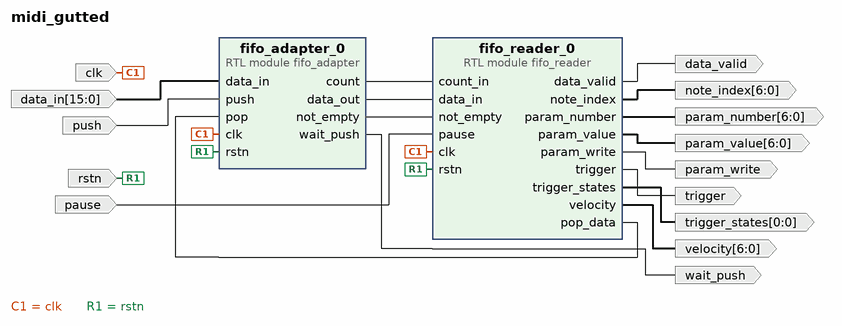
[diagram p0: block diagram of the top level]
# Vivado block design midi_gutted, xc7z020clg400-1, Vivado 2021.1
create_bd_design midi_gutted

create_bd_port -dir I -type clk clk
set_property -dict {CONFIG.FREQ_HZ 100000000} [get_bd_ports clk]
create_bd_port -dir I -type rst rstn
set_property -dict {CONFIG.POLARITY ACTIVE_LOW} [get_bd_ports rstn]
create_bd_port -dir I -from 15 -to 0 data_in
create_bd_port -dir I push
create_bd_port -dir O wait_push
create_bd_port -dir O data_valid
create_bd_port -dir O -from 6 -to 0 note_index
create_bd_port -dir O -from 6 -to 0 param_number
create_bd_port -dir O -from 6 -to 0 param_value
create_bd_port -dir O param_write
create_bd_port -dir I pause
create_bd_port -dir O trigger
create_bd_port -dir O -from 0 -to 0 trigger_states
create_bd_port -dir O -from 6 -to 0 velocity

create_bd_cell -type module -reference fifo_adapter fifo_adapter_0
create_bd_cell -type module -reference fifo_reader fifo_reader_0

# ---- connections ----

connect_bd_net [get_bd_ports clk] [get_bd_pins fifo_adapter_0/clk] [get_bd_pins fifo_reader_0/clk]
connect_bd_net -net data_in_0_1 [get_bd_ports data_in] [get_bd_pins fifo_adapter_0/data_in]
connect_bd_net [get_bd_pins fifo_adapter_0/count] [get_bd_pins fifo_reader_0/count_in]
connect_bd_net [get_bd_pins fifo_adapter_0/data_out] [get_bd_pins fifo_reader_0/data_in]
connect_bd_net [get_bd_pins fifo_adapter_0/not_empty] [get_bd_pins fifo_reader_0/not_empty]
connect_bd_net [get_bd_pins fifo_adapter_0/wait_push] [get_bd_ports wait_push]
connect_bd_net [get_bd_pins fifo_reader_0/data_valid] [get_bd_ports data_valid]
connect_bd_net [get_bd_pins fifo_reader_0/note_index] [get_bd_ports note_index]
connect_bd_net [get_bd_pins fifo_reader_0/param_number] [get_bd_ports param_number]
connect_bd_net [get_bd_pins fifo_reader_0/param_value] [get_bd_ports param_value]
connect_bd_net [get_bd_pins fifo_reader_0/param_write] [get_bd_ports param_write]
connect_bd_net [get_bd_pins fifo_reader_0/pop_data] [get_bd_pins fifo_adapter_0/pop]
connect_bd_net [get_bd_pins fifo_reader_0/trigger] [get_bd_ports trigger]
connect_bd_net [get_bd_pins fifo_reader_0/trigger_states] [get_bd_ports trigger_states]
connect_bd_net [get_bd_pins fifo_reader_0/velocity] [get_bd_ports velocity]
connect_bd_net -net pause_0_1 [get_bd_ports pause] [get_bd_pins fifo_reader_0/pause]
connect_bd_net -net push_0_1 [get_bd_ports push] [get_bd_pins fifo_adapter_0/push]
connect_bd_net [get_bd_ports rstn] [get_bd_pins fifo_adapter_0/rstn] [get_bd_pins fifo_reader_0/rstn]

validate_bd_design
save_bd_design
